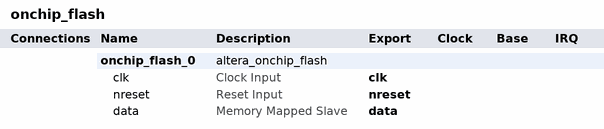
[diagram p0: system contents]
# Platform Designer (Qsys) system onchip_flash, MAX 10 10M08SCE144C8G
# Parameters at their usual value, and those the tool derives, are not listed.
package require -exact qsys 20.1
create_system onchip_flash
set_project_property DEVICE_FAMILY {MAX 10}
set_project_property DEVICE 10M08SCE144C8G

add_instance onchip_flash_0 altera_onchip_flash 20.1
set_instance_property onchip_flash_0 AUTO_EXPORT true
set_instance_parameter_value onchip_flash_0 CLOCK_FREQUENCY 100.0
set_instance_parameter_value onchip_flash_0 CONFIGURATION_MODE {Single Compressed Image}
set_instance_parameter_value onchip_flash_0 READ_BURST_COUNT 2
set_instance_parameter_value onchip_flash_0 SECTOR_ACCESS_MODE {Read only,Read only,Hidden,Read only,Hidden}
set_instance_parameter_value onchip_flash_0 initFlashContent true
set_instance_parameter_value onchip_flash_0 initializationFileName ../sw/bootloader/build/SummerLoader64.hex
set_instance_parameter_value onchip_flash_0 initializationFileNameForSim ../sw/bootloader/build/SummerLoader64.hex
set_instance_parameter_value onchip_flash_0 useNonDefaultInitFile true

# exported interfaces
add_interface clk clock sink
set_interface_property clk EXPORT_OF onchip_flash_0.clk
add_interface data avalon slave
set_interface_property data EXPORT_OF onchip_flash_0.data
add_interface nreset reset sink
set_interface_property nreset EXPORT_OF onchip_flash_0.nreset

set_interconnect_requirement {$system} qsys_mm.clockCrossingAdapter HANDSHAKE
set_interconnect_requirement {$system} qsys_mm.enableEccProtection FALSE
set_interconnect_requirement {$system} qsys_mm.insertDefaultSlave FALSE
set_interconnect_requirement {$system} qsys_mm.maxAdditionalLatency 1

save_system onchip_flash.qsys
